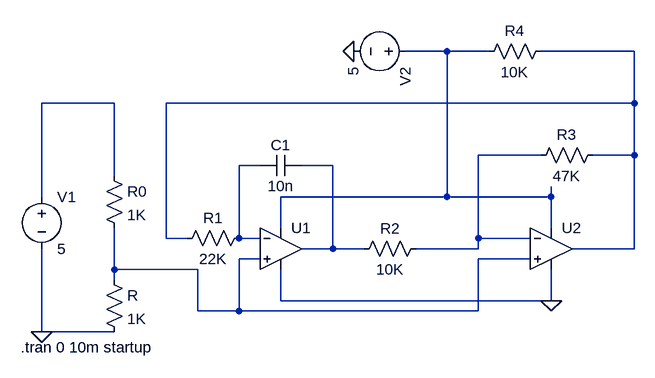
[diagram p0: schematic Exp1.asc]
Exp1.asc, the LTspice schematic file:
Version 4
SHEET 1 880 680
WIRE 96 -112 32 -112
WIRE 160 -112 96 -112
WIRE 384 -112 240 -112
WIRE -416 -32 -528 -32
WIRE 384 -32 384 -112
WIRE 384 -32 -336 -32
WIRE 240 48 144 48
WIRE 384 48 384 -32
WIRE 384 48 320 48
WIRE -192 64 -224 64
WIRE -80 64 -128 64
WIRE -416 80 -416 -32
WIRE -528 112 -528 -32
WIRE 96 112 96 -112
WIRE 96 112 -160 112
WIRE 256 112 256 96
WIRE 256 112 96 112
WIRE -160 160 -160 112
WIRE 256 160 256 112
WIRE -336 176 -336 -32
WIRE -304 176 -336 176
WIRE -224 176 -224 64
WIRE -192 176 -224 176
WIRE 144 176 144 48
WIRE 224 176 144 176
WIRE -80 192 -80 64
WIRE -80 192 -128 192
WIRE -32 192 -80 192
WIRE 144 192 144 176
WIRE 144 192 48 192
WIRE 384 192 384 48
WIRE 384 192 288 192
WIRE -192 208 -224 208
WIRE 224 208 144 208
WIRE -416 224 -416 160
WIRE -288 224 -416 224
WIRE -416 240 -416 224
WIRE -160 272 -160 224
WIRE 256 272 256 224
WIRE 256 272 -160 272
WIRE -288 288 -288 224
WIRE -224 288 -224 208
WIRE -224 288 -288 288
WIRE 144 288 144 208
WIRE 144 288 -224 288
WIRE -528 320 -528 192
WIRE -416 320 -528 320
FLAG -528 320 0
FLAG -48 -112 0
FLAG 256 272 0
SYMBOL res -432 64 R0
SYMATTR InstName R0
SYMATTR Value 1K
SYMBOL res -432 224 R0
SYMATTR InstName R
SYMATTR Value 1K
SYMBOL res -208 160 R90
WINDOW 0 0 56 VBottom 2
WINDOW 3 32 56 VTop 2
SYMATTR InstName R1
SYMATTR Value 22K
SYMBOL res 336 32 R90
WINDOW 0 0 56 VBottom 2
WINDOW 3 32 56 VTop 2
SYMATTR InstName R3
SYMATTR Value 47K
SYMBOL res 64 176 R90
WINDOW 0 0 56 VBottom 2
WINDOW 3 32 56 VTop 2
SYMATTR InstName R2
SYMATTR Value 10K
SYMBOL cap -128 48 R90
WINDOW 0 0 32 VBottom 2
WINDOW 3 32 32 VTop 2
SYMATTR InstName C1
SYMATTR Value 10n
SYMBOL voltage -528 96 R0
WINDOW 123 0 0 Left 0
WINDOW 39 0 0 Left 0
SYMATTR InstName V1
SYMATTR Value 5
SYMBOL voltage 48 -112 R90
WINDOW 123 0 0 Left 0
WINDOW 39 0 0 Left 0
SYMATTR InstName V2
SYMATTR Value 5
SYMBOL res 256 -128 R90
WINDOW 0 0 56 VBottom 2
WINDOW 3 32 56 VTop 2
SYMATTR InstName R4
SYMATTR Value 10K
SYMBOL OpAmps/UniversalOpAmp2 -160 192 R0
SYMATTR InstName U1
SYMATTR SpiceLine Avol=100K GBW=1Meg Slew=10Meg Ilimit=25m Rail=5 Rinput=1Meg Rout=100
SYMBOL OpAmps/UniversalOpAmp2 256 192 R0
SYMATTR InstName U2
SYMATTR SpiceLine Avol=1Meg GBW=100Meg Slew=500Meg Ilimit=25m Rail=5 Rinput=1Meg Rout=1
TEXT -560 344 Left 2 !.tran 0 10m startup

The netlist it stands for:
* Exp1.asc
R0 N003 N007 1K
R N007 0 1K
R1 N005 N002 22K
R3 N002 N004 47K
R2 N004 N006 10K
C1 N006 N005 10n
V1 N003 0 5
V2 N001 0 5
R4 N002 N001 10K
XU1 N007 N005 N001 0 N006 level2 Avol=1Meg GBW=10Meg Slew=10Meg Avol=100K GBW=1Meg Slew=10Meg Ilimit=25m Rail=5 Rinput=1Meg Rout=100 En=0 Enk=0 In=0 Ink=0 Rin=500Meg  ; pins In+ In- V+ V- OUT
XU2 N007 N004 N001 0 N002 level2 Avol=1Meg GBW=10Meg Slew=10Meg Avol=1Meg GBW=100Meg Slew=500Meg Ilimit=25m Rail=5 Rinput=1Meg Rout=1 En=0 Enk=0 In=0 Ink=0 Rin=500Meg  ; pins In+ In- V+ V- OUT
.tran 0 10m startup
.lib UniversalOpAmp2.lib
.backanno
.end